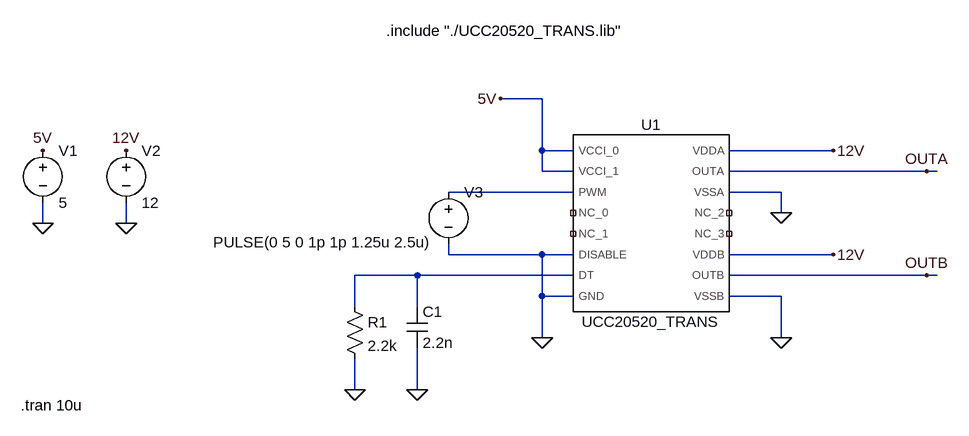
[diagram p0: schematic Delay-GateDriver.asc]
Delay-GateDriver.asc, the LTspice schematic file:
Version 4
SHEET 1 880 680
WIRE -16 -32 -80 -32
WIRE -16 48 -16 -32
WIRE 32 48 -16 48
WIRE 432 48 272 48
WIRE -16 80 -16 48
WIRE 32 80 -16 80
WIRE 576 80 272 80
WIRE 592 80 576 80
WIRE 32 112 -160 112
WIRE 352 112 272 112
WIRE 352 144 352 112
WIRE -784 160 -784 128
WIRE -656 160 -656 128
WIRE -160 208 -160 192
WIRE -16 208 -160 208
WIRE 32 208 -16 208
WIRE 432 208 272 208
WIRE -208 240 -304 240
WIRE 32 240 -208 240
WIRE 576 240 272 240
WIRE 592 240 576 240
WIRE -16 272 -16 208
WIRE 32 272 -16 272
WIRE 352 272 272 272
WIRE -304 288 -304 240
WIRE -208 288 -208 240
WIRE -16 336 -16 272
WIRE 352 336 352 272
WIRE -304 416 -304 368
WIRE -208 416 -208 352
FLAG -80 -32 5V
FLAG -16 336 0
FLAG 352 144 0
FLAG 352 336 0
FLAG 432 208 12V
FLAG 432 48 12V
FLAG 576 80 OUTA
FLAG 576 240 OUTB
FLAG -304 416 0
FLAG -208 416 0
FLAG -656 160 0
FLAG -784 160 0
FLAG -784 48 5V
FLAG -656 48 12V
SYMBOL UCC20520_TRANS 144 160 R0
SYMATTR InstName U1
SYMBOL res -320 272 R0
SYMATTR InstName R1
SYMATTR Value 2.2k
SYMBOL cap -224 288 R0
SYMATTR InstName C1
SYMATTR Value 2.2n
SYMBOL voltage -784 32 R0
WINDOW 123 0 0 Left 0
WINDOW 39 0 0 Left 0
SYMATTR InstName V1
SYMATTR Value 5
SYMBOL voltage -656 32 R0
WINDOW 123 0 0 Left 0
WINDOW 39 0 0 Left 0
SYMATTR InstName V2
SYMATTR Value 12
SYMBOL voltage -160 96 R0
WINDOW 3 -362 93 Left 2
WINDOW 123 0 0 Left 0
WINDOW 39 0 0 Left 0
SYMATTR InstName V3
SYMATTR Value PULSE(0 5 0 1p 1p 1.25u 2.5u)
TEXT -256 -136 Left 2 !.include "./UCC20520_TRANS.lib"
TEXT -818 440 Left 2 !.tran 10u

The netlist it stands for:
* Delay-GateDriver.asc
XU1 0 N002 0 NC_01 NC_02 NC_03 NC_04 OUTA OUTB N001 5V 5V 12V 12V 0 0 UCC20520_TRANS  ; pins DISABLE DT GND NC_0 NC_1 NC_2 NC_3 OUTA OUTB PWM VCCI_0 VCCI_1 VDDA VDDB VSSA VSSB
R1 N002 0 2.2k
C1 N002 0 2.2n
V1 5V 0 5
V2 12V 0 12
V3 N001 0 PULSE(0 5 0 1p 1p 1.25u 2.5u)
.include "./UCC20520_TRANS.lib"
.tran 10u
.backanno
.end